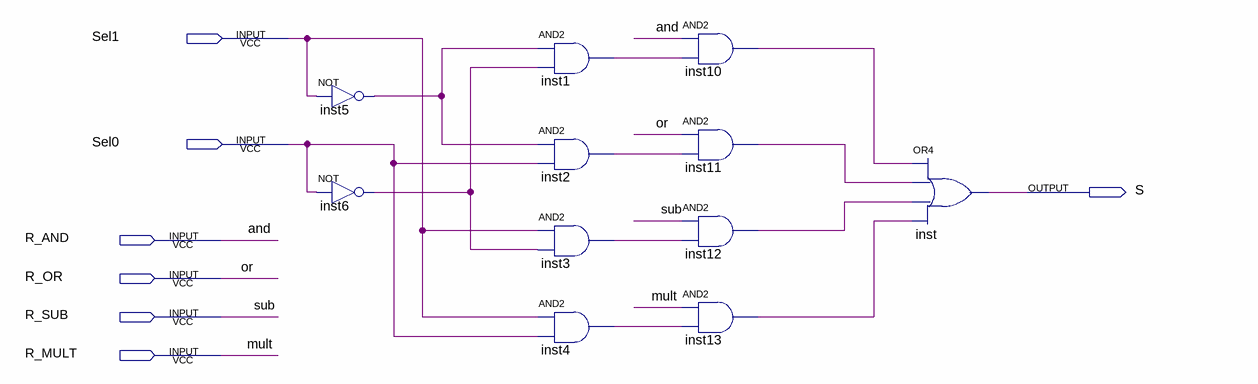
[diagram p0: schematic sheet]
// Quartus schematic Decodificador.bdf as structural Verilog: 11 symbols, 7 pins
module Decodificador (
  input  Sel1,
  input  Sel0,
  input  R_AND,
  input  R_OR,
  input  R_SUB,
  input  R_MULT,
  output S
);

  wire inst1_out, inst2_out, inst3_out, inst4_out, inst5_out, inst6_out, inst10_out, inst11_out, inst12_out,
       inst13_out;

  not inst5 (inst5_out, Sel1);
  not inst6 (inst6_out, Sel0);
  and inst1 (inst1_out, inst5_out, inst6_out);
  and inst2 (inst2_out, inst5_out, Sel0);
  and inst3 (inst3_out, Sel1, inst6_out);
  and inst4 (inst4_out, Sel1, Sel0);
  and inst10 (inst10_out, R_AND, inst1_out);
  and inst11 (inst11_out, R_OR, inst2_out);
  and inst12 (inst12_out, R_SUB, inst3_out);
  and inst13 (inst13_out, R_MULT, inst4_out);
  or inst (S, inst10_out, inst11_out, inst12_out, inst13_out);

  // Other names for the same wires on the sheet: and = R_AND; mult = R_MULT; or = R_OR; sub = R_SUB
endmodule
